# Altium schematic sheet motor_driver.SchDoc
size A
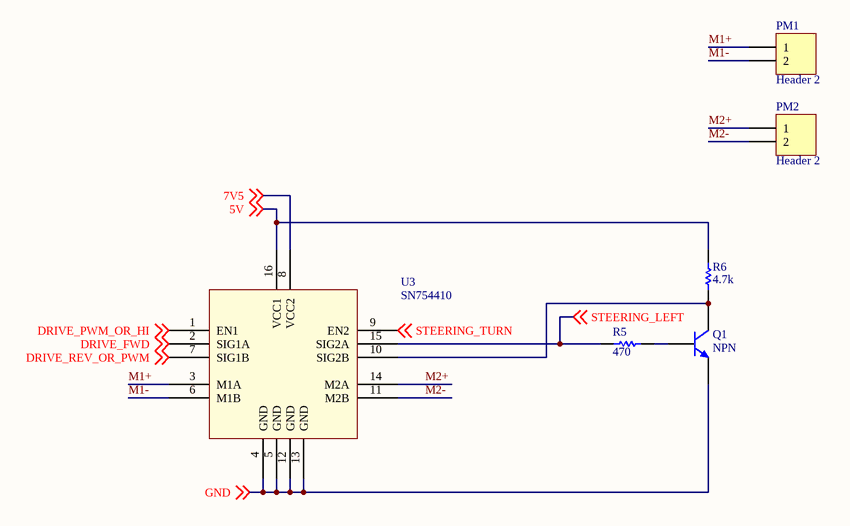
[diagram p0: motor_driver.SchDoc]

## Parts
PM1  Header 2  [HDR1X2]
PM2  Header 2  [HDR1X2]
Q1  NPN  [SOT23]
R5  value 470  [0805-R]  (hidden comment: Res1)
R6  value 4.7k  [0805-R]  (hidden comment: Res1)
U3  SN754410  [DIP16]

## Nets
5V: R6.2 U3.16(VCC1) ; off-sheet 5V
7V5: U3.8(VCC2) ; off-sheet 7V5
DRIVE_FWD: U3.2(SIG1A) ; off-sheet DRIVE_FWD
DRIVE_PWM_OR_HI: U3.1(EN1) ; off-sheet DRIVE_PWM_OR_HI
DRIVE_REV_OR_PWM: U3.7(SIG1B) ; off-sheet DRIVE_REV_OR_PWM
GND: Q1.3(E) U3.4(GND) U3.5(GND) U3.12(GND) U3.13(GND) ; off-sheet GND
M1+: PM1.1 U3.3(M1A)
M1-: PM1.2 U3.6(M1B)
M2+: PM2.1 U3.14(M2A)
M2-: PM2.2 U3.11(M2B)
STEERING_LEFT: R5.1 U3.15(SIG2A) ; off-sheet STEERING_LEFT
STEERING_TURN: U3.9(EN2) ; off-sheet STEERING_TURN
NetQ1_1: Q1.1(C) R6.1 U3.10(SIG2B)
NetQ1_2: Q1.2(B) R5.2

## Library data of the parts
PM1 PM2 = Header 2: Header, 2-Pin; LatestRevisionDate: 17-Jul-2002; LatestRevisionNote: Re-released for DXP Platform.; Publisher: Altium Limited
Q1 = NPN: NPN Bipolar Transistor; pin to pad: 1>3 2>1 3>2; Published: 8-Jun-2000; LatestRevisionDate: 17-Jul-2002; LatestRevisionNote: Re-released for DXP Platform.; PackageReference: TO-226-AA; Publisher: Altium Limited; PackageDescription: TO, Flat Index; 3 In-Line, Axial Leads; Body Dia. 4.8mm; Leads 0.55 x 0.51 mm (max); Code_JEDEC: TO-226-AA
R5 R6 = Res1: Resistor; Published: 8-Jun-2000; LatestRevisionDate: 17-Jul-2002; LatestRevisionNote: Re-released for DXP Platform.; PackageReference: AXIAL-0.3; Publisher: Altium Limited; PackageDescription: Axial Device, Thru-Hole; 2 Leads; 0.3 in Pin Spacing